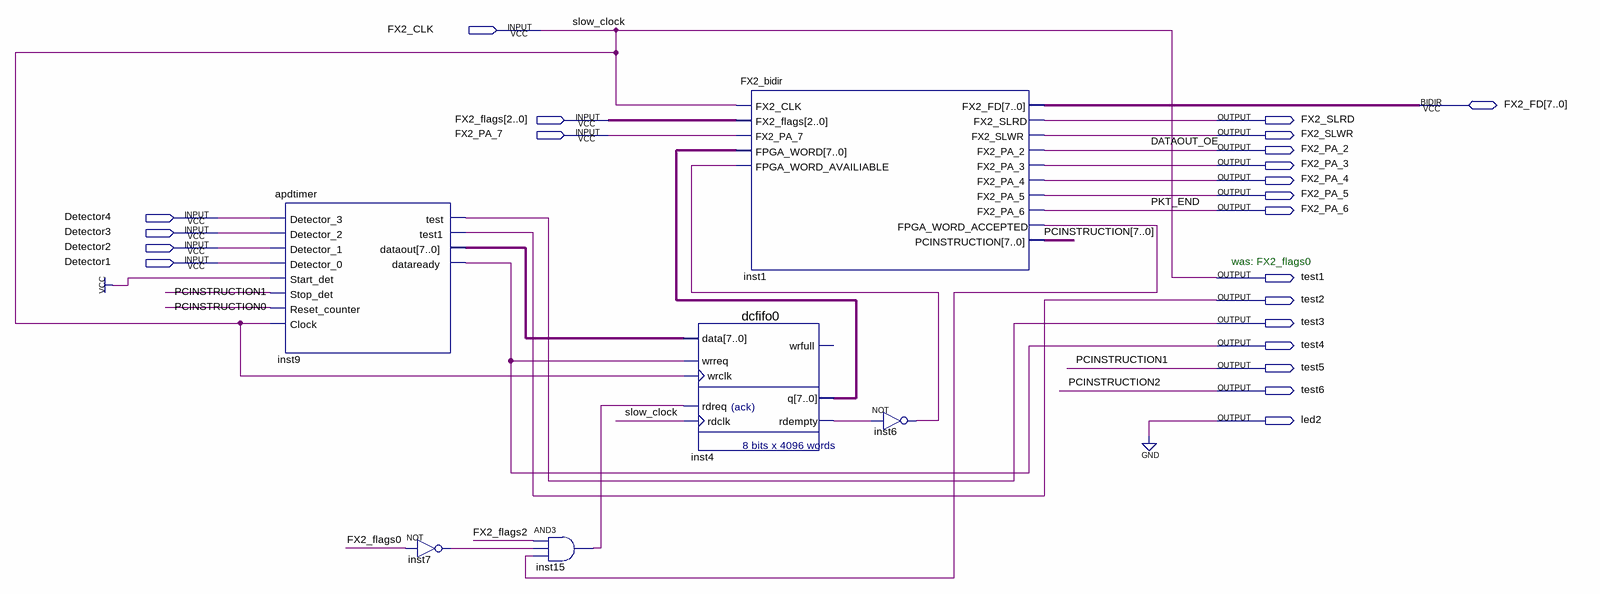
[diagram p0: schematic sheet]
// Quartus schematic testingigo.bdf as structural Verilog: 6 symbols, 22 pins
module testingigo (
  input  FX2_CLK,
  input  [2:0] FX2_flags,
  input  FX2_PA_7,
  input  Detector4,
  input  Detector3,
  input  Detector2,
  input  Detector1,
  inout  [7:0] FX2_FD,
  output FX2_SLRD,
  output FX2_SLWR,
  output FX2_PA_2,
  output FX2_PA_3,
  output FX2_PA_4,
  output FX2_PA_5,
  output FX2_PA_6,
  output test1,
  output test2,
  output test3,
  output test4,
  output test5,
  output test6,
  output led2
);

  wire inst1_fpga_word_accepted, inst4_rdempty, inst6_out, inst7_out, inst15_out;
  wire [7:0] inst4_q, inst9_dataout, PCINSTRUCTION;

  apdtimer inst9 (
    .Detector_3(Detector4), .Detector_2(Detector3), .Detector_1(Detector2), .Detector_0(Detector1),
    .Start_det(1'b1), .Stop_det(test5), .Reset_counter(PCINSTRUCTION[0]), .Clock(FX2_CLK), .test(test3),
    .test1(test2), .dataout(inst9_dataout), .dataready(test4));
  not inst7 (inst7_out, FX2_flags[0]);
  and inst15 (inst15_out, FX2_flags[2], inst7_out, inst1_fpga_word_accepted);
  FX2_bidir inst1 (
    .FX2_CLK(FX2_CLK), .FX2_flags(FX2_flags), .FX2_PA_7(FX2_PA_7), .FPGA_WORD(inst4_q),
    .FPGA_WORD_AVAILIABLE(inst6_out), .FX2_SLRD(FX2_SLRD), .FX2_SLWR(FX2_SLWR), .FX2_PA_2(FX2_PA_2),
    .FX2_PA_3(FX2_PA_3), .FX2_PA_4(FX2_PA_4), .FX2_PA_5(FX2_PA_5), .FX2_PA_6(FX2_PA_6),
    .FPGA_WORD_ACCEPTED(inst1_fpga_word_accepted),
    .PCINSTRUCTION({PCINSTRUCTION[7:3], test6, test5, PCINSTRUCTION[0]}), .FX2_FD(FX2_FD));
  dcfifo0 inst4 (
    .data(inst9_dataout), .wrreq(test4), .wrclk(FX2_CLK), .rdreq(inst15_out), .rdclk(FX2_CLK), .q(inst4_q),
    .rdempty(inst4_rdempty));  // open: wrfull
  not inst6 (inst6_out, inst4_rdempty);

  assign led2 = 1'b0;
  assign test1 = FX2_CLK;

  // Other names for the same wires on the sheet: DATAOUT_OE = FX2_PA_2; PCINSTRUCTION[2:1] = {test6, test5};
  //   PCINSTRUCTION1 = test5; PCINSTRUCTION2 = test6; PKT_END = FX2_PA_6; slow_clock = FX2_CLK

  // Notes on the sheet:
  //   was: FX2_flags0
endmodule
